# Altium schematic sheet IRF7317+TR.SchDoc
size A4
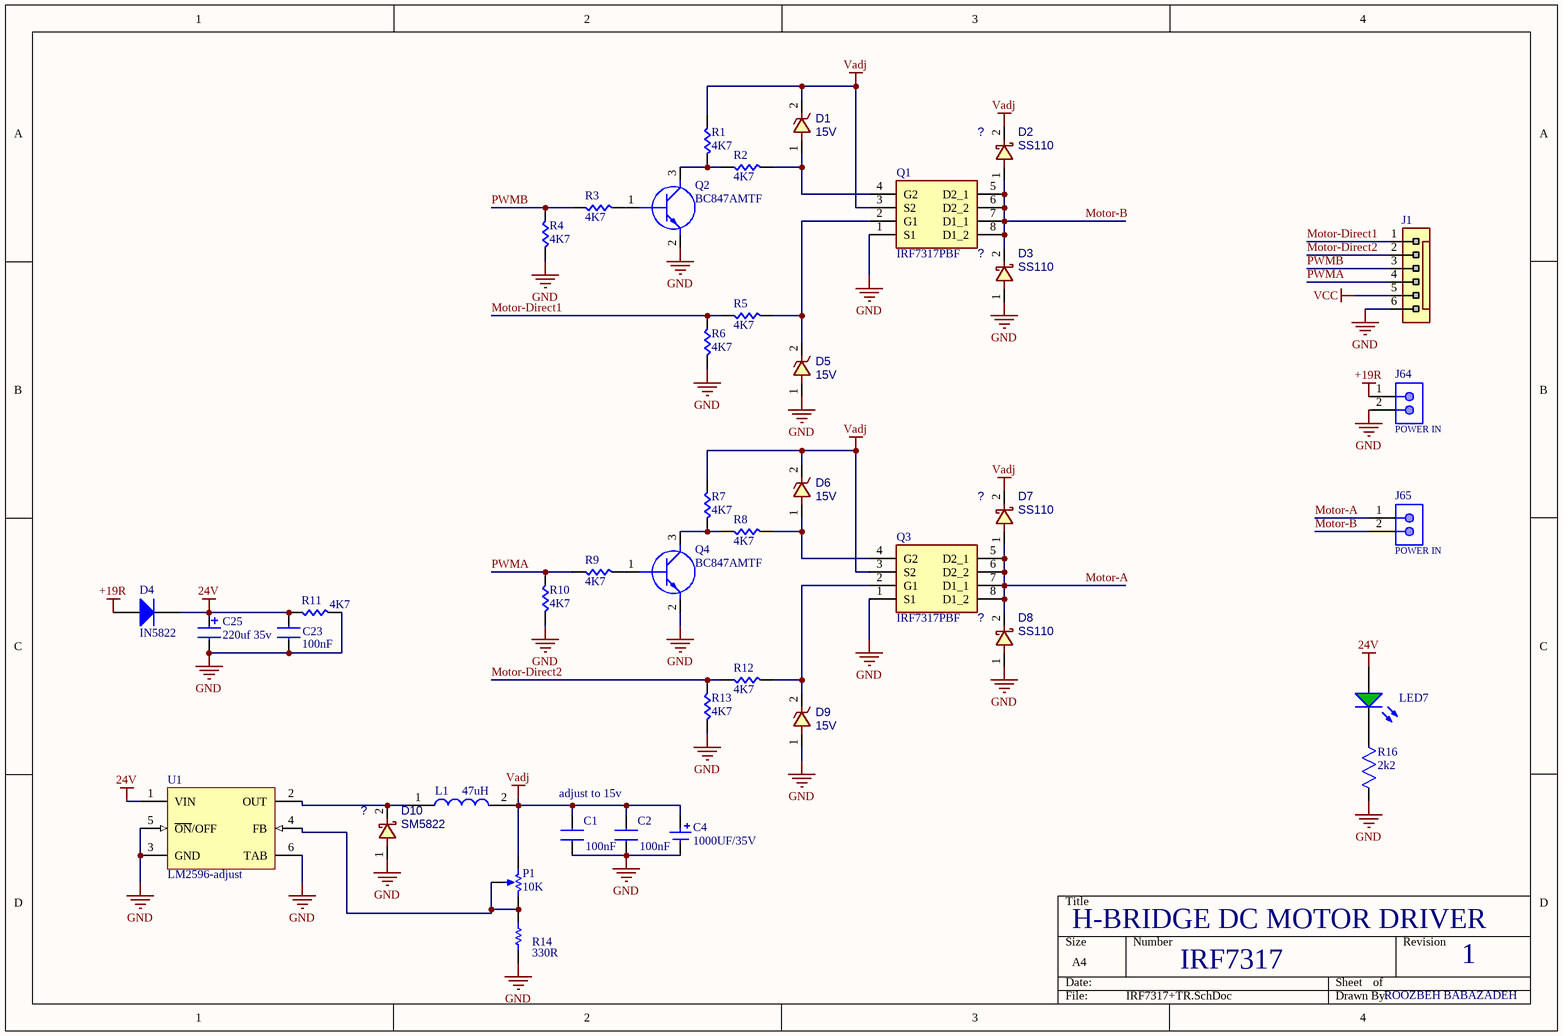
[diagram p0: IRF7317+TR.SchDoc]

## Parts
C1  100nF  [C0805]
C2  100nF  [C0805]
C4  1000UF/35V  [C_EL_12X25]
C23  100nF  [C0805]
C25  220uf 35v  [C_EL_10X12]
D1  15V  [D_SOD80]
D2  SS110  [D_SMA]
D3  SS110  [D_SMA]
D4  IN5822  [D_SMB]
D5  15V  [D_SOD80]
D6  15V  [D_SOD80]
D7  SS110  [D_SMA]
D8  SS110  [D_SMA]
D9  15V  [D_SOD80]
D10  SM5822  [D_SMB]
J1  HDRWF_6  [WF_6]  (value not drawn)
J64  POWER IN  [PWL_2]
J65  POWER IN  [PWL_2]
L1  47uH  [CDRH127LDNP560MC-12*12]
LED7  (no value)  [LED1206RED]
P1  10K  [POT_3296W]
Q1  IRF7317PBF  [SO_8]
Q2  BC847AMTF  [SOT23]
Q3  IRF7317PBF  [SO_8]
Q4  BC847AMTF  [SOT23]
R1  4K7  [R0805]
R2  4K7  [R0805]
R3  4K7  [R0805]
R4  4K7  [R0805]
R5  4K7  [R0805]
R6  4K7  [R0805]
R7  4K7  [R0805]
R8  4K7  [R0805]
R9  4K7  [R0805]
R10  4K7  [R0805]
R11  4K7  [R0805]
R12  4K7  [R0805]
R13  4K7  [R0805]
R14  330R  [R0805]
R16  2k2  [R0805]
U1  LM2596-adjust  [to-263-5 5d2pak LM2596S]

## Nets
24V: C23.2 C25.1 D4.2(K) LED7.1(A) R11.2 U1.1(VIN)
+19R: D4.1(A) J64.1
GND: C1.1 C2.1 C4.2 C23.1 C25.2 D3.1 D5.1 D8.1 D9.1 D10.1 J1.6 J64.2 Q1.1(S1) Q2.2(E) Q3.1(S1) Q4.2(E) R4.1 R6.2 R10.1 R11.1 R13.2 R14.1 R16.2 U1.3(GND) U1.5(~{ON}/OFF) U1.6(TAB)
Vadj: C1.2 C2.2 C4.1 D1.2 D2.2 D6.2 D7.2 L1.2 P1.3(BOT) Q1.3(S2) Q3.3(S2) R1.1 R7.1
VCC: J1.5
Motor-A: D7.1 D8.2 J65.1 Q3.5(D2_1) Q3.6(D2_2) Q3.7(D1_1) Q3.8(D1_2)
Motor-B: D2.1 D3.2 J65.2 Q1.5(D2_1) Q1.6(D2_2) Q1.7(D1_1) Q1.8(D1_2)
Motor-Direct1: J1.1 R5.2 R6.1
Motor-Direct2: J1.2 R12.2 R13.1
PWMA: J1.4 R9.1 R10.2
PWMB: J1.3 R3.1 R4.2
NetD1_1: D1.1 Q1.4(G2) R2.1
NetD5_2: D5.2 Q1.2(G1) R5.1
NetD6_1: D6.1 Q3.4(G2) R8.1
NetD9_2: D9.2 Q3.2(G1) R12.1
NetD10_2: D10.2 L1.1 U1.2(OUT)
NetLED7_2: LED7.2(K) R16.1
NetP1_1: P1.1(TOP) P1.2(TAP) R14.2 U1.4(FB)
NetQ2_1: Q2.1(B) R3.2
NetQ2_3: Q2.3(C) R1.2 R2.2
NetQ4_1: Q4.1(B) R9.2
NetQ4_3: Q4.3(C) R7.2 R8.2

## Notes on the sheet
- adjust to 15v
- H-BRIDGE DC MOTOR DRIVER
- IRF7317
- 1
- ROOZBEH BABAZADEH

## Library data of the parts
C1 C2 C23 = C
C4 = CAP_ELECTRO_POLIMER
C25 = CAP3528
D1 D5 D6 D9 = ZENER: DIODE, ZENER, 3W, 5.6V; MANF: MCC; DESC: DESCRIPTION; PARAM2: 0.5W, 2Ohm, 67mA, -55~150oC; MANF_P#: 3SMAJ5919B-TP; ASSEMBLY: ASSEMBLY; PRICE: 0.5$; PARAM: 5.6V
D2 D3 D7 D8 D10 = SCHOTTKY: DIODE, SCHOTTKY, 40V, 1A; MANF: DIODES; MANF_P#: 1N5819HW-7-F; DESC: DESCRIPTION; ASSEMBLY: ASSEMBLY; PRICE: PRICE; PARAM2: 1A; PARAM: 40V; VALUE: ?
D4 = Diode 1N4005: 1 Amp General Purpose Rectifier; Published: 8-Jun-2000; LatestRevisionDate: 17-Jul-2002; LatestRevisionNote: Re-released for DXP Platform.; DatasheetVersion: 1998; PackageVersion: Aug-1999; PackageReference: DO-41; Publisher: Altium Limited; PackageDescription: Diode, Axial; Body 5.2 x 2.7 mm (LxDia. max), Lead Dia. 0.86 mm (max); Code_JEDEC: DO-204-AL; ComponentLink1Description: Manufacturer Link; ComponentLink1URL: http://www.fairchildsemi.com/; ComponentLink2Description: Datasheet; ComponentLink2URL: http://www.fairchildsemi.com/ds/1N%2F1N4001.pdf
J1 = HDRWF_6: Header, WF, Pitch: 2.54mm; VALUE: HDRWF_6
J64 J65 = sip 2: WR-PHD Pin Header, THT, pitch 2.54mm, Single Row, Vertical, 2pin; Part Number: 61300211121; Pin Number: 2; Gender: Male; Rated Current: 3A; Working Voltage: 250VAC; Withstanding Voltage: 500VAC; Contact Resistance: 20mOhm; ComponentLink1Description: Manufacturer; ComponentLink1URL: http://www.we-online.de; ComponentLink2Description: Datasheet; ComponentLink2URL: https://katalog.we-online.de/em/datasheet/6130xx11121.pdf; Published Date: June 2019; Publisher: Wurth Elektronik; Pitch: 2.54mm; Operating Temperature: -40 to +105degC; Mounting Technology: THT; Packaging: Bag; Row Number: Single; Orientation: Vertical
L1 = CDRH127_LDNP-560MC: Inductor; Manufacturer_Name: Sumida; Manufacturer_Part_Number: CDRH127/LDNP-560MC; Datasheet Link: https://www.arrow.com/en/products/cdrh127ldnp-560mc/sumida; Height: 8mm; Arrow Part Number: CDRH127/LDNP-560MC; Arrow Price/Stock: https://www.arrow.com/en/products/cdrh127ldnp-560mc/sumida; Mouser Part Number: 851-CDRH127LDNP560MC; Mouser Price/Stock: https://www.mouser.co.uk/ProductDetail/Sumida/CDRH127-LDNP-560MC?qs=IXCoV6m%252B579ap3iATSRauQ%3D%3D
LED7 = LED3mm
P1 = Multi-Turn: Potentiometer
Q1 Q3 = IRF7317PBF: Transistor; Manufacturer_Name: Infineon; Datasheet Link: http://www.infineon.com/dgdl/irf7317pbf.pdf?fileId=5546d462533600a4015355f5b8de1b3d; Height: 1.75mm; Manufacturer_Part_Number: IRF7317PBF; Arrow Part Number: IRF7317PBF; Arrow Price/Stock: https://www.arrow.com/en/products/irf7317pbf/infineon-technologies-ag; Mouser Part Number: 942-IRF7317PBF; Mouser Price/Stock: https://www.mouser.com/Search/Refine.aspx?Keyword=942-IRF7317PBF
Q2 Q4 = BC847AMTF: Transistor BJT NPN; Manufacturer_Name: ON Semiconductor; Datasheet Link: http://www.onsemi.com/pub/Collateral/BC846-D.PDF; Height: 1.2mm; Manufacturer_Part_Number: BC847AMTF; Arrow Part Number: BC847AMTF; Arrow Price/Stock: https://www.arrow.com/en/products/bc847amtf/on-semiconductor; Mouser Part Number: 512-BC847AMTF; Mouser Price/Stock: https://www.mouser.com/Search/Refine.aspx?Keyword=512-BC847AMTF
R1-R13 R16 = R
R14 = Res1: Resistor; Published: 8-Jun-2000; LatestRevisionDate: 17-Jul-2002; LatestRevisionNote: Re-released for DXP Platform.; PackageReference: AXIAL-0.3; Publisher: Altium Limited; PackageDescription: Axial Device, Thru-Hole; 2 Leads; 0.3 in Pin Spacing; Value: 330R
U1 = LM2596s